# Altium schematic sheet 4 - IO Socket 2.SchDoc
size A4
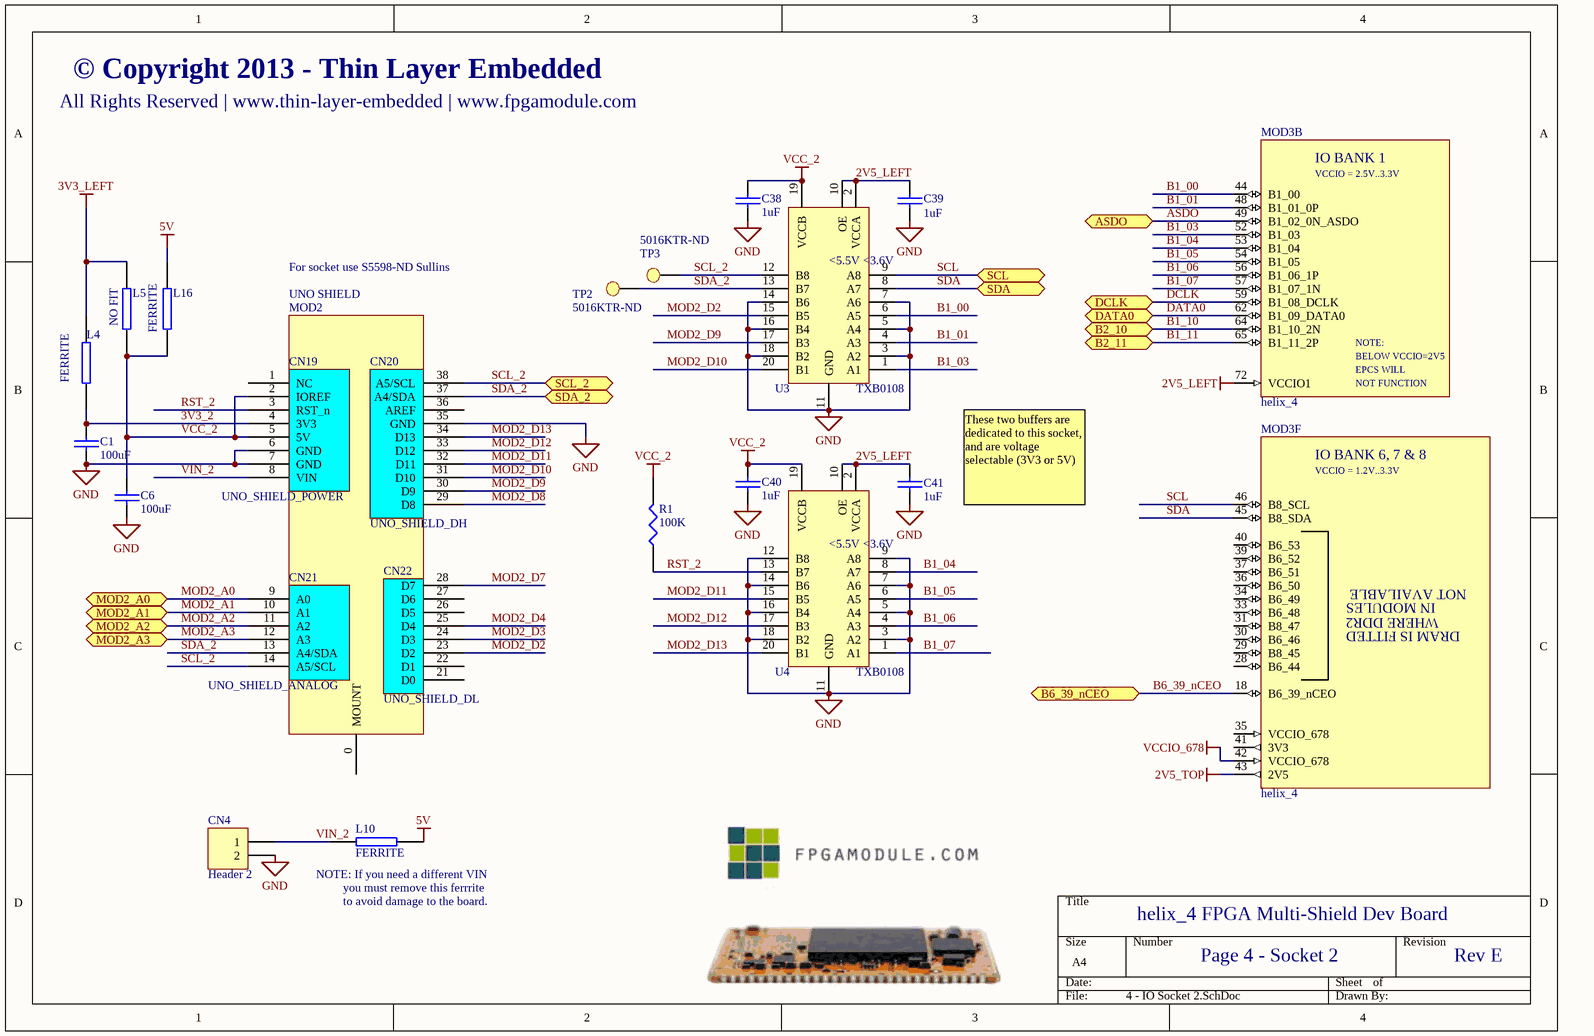
[diagram p0: 4 - IO Socket 2.SchDoc]

## Parts
C1  100uF  [1210]
C6  100uF  [1210]
C38  1uF  [0805]
C39  1uF  [0805]
C40  1uF  [0805]
C41  1uF  [0805]
CN4  Header 2  [HDR1X2]
CN19  UNO_SHIELD_POWER  [UNO_SHIELD_POWER]
CN20  UNO_SHIELD_DH  [UNO_SHIELD_DH]
CN21  UNO_SHIELD_ANALOG  [UNO_SHIELD_ANALOG]
CN22  UNO_SHIELD_DL  [UNO_SHIELD_DL]
L4  FERRITE  [0805]
L5  NO FIT  [0805]
L10  FERRITE  [0805]
L16  FERRITE  [0805]
MOD2  UNO SHIELD  [UNO_SHIELD_MECH]
MOD3  helix_4  [HELIX_4_LCC104_HOST]  (parts B,F of 7)
R1  100K  [0805]
TP2  Supplier Part Number 2: 5016KTR-ND  [TEST_POINT]  (hidden comment: Test Point)
TP3  Supplier Part Number 2: 5016KTR-ND  [TEST_POINT]  (hidden comment: Test Point)
U3  TXB0108  [TSSOP20]
U4  TXB0108  [TSSOP20]

## Ports
ASDO, B2_10, B2_11, B6_39_nCEO, DATA0, DCLK, MOD2_A0, MOD2_A1, MOD2_A2, MOD2_A3, SCL, SCL_2, SDA, SDA_2

## Nets
2V5_LEFT: C39.2 C41.2 MOD3.72(VCCIO1) U3.2(VCCA) U3.10(OE) U4.2(VCCA) U4.10(OE)
2V5_TOP: MOD3.43(2V5)
3V3_LEFT: L4.1 L5.1
5V: L10.1 L16.1
GND: C1.2 C6.2 C38.1 C39.1 C40.1 C41.1 CN4.2 CN19.6(GND) CN19.7(GND) CN20.35(GND) U3.3(A2) U3.5(A4) U3.7(A6) U3.11(GND) U3.14(B6) U3.16(B4) U3.18(B2) U4.3(A2) U4.5(A4) U4.7(A6) U4.9(A8) U4.11(GND) U4.12(B8) U4.14(B6) U4.16(B4) U4.18(B2)
VCC_2: C6.1 C38.2 C40.2 CN19.2(IOREF) CN19.5(5V) L5.2 L16.2 R1.2 U3.19(VCCB) U4.19(VCCB)
VCCIO_678: MOD3.42(VCCIO_678)
3V3_2: C1.1 CN19.4(3V3) L4.2
ASDO: MOD3.49(B1_02_0N_ASDO) ; port ASDO
B1_00: MOD3.44(B1_00) U3.6(A5)
B1_01: MOD3.48(B1_01_0P) U3.4(A3)
B1_03: MOD3.52(B1_03) U3.1(A1)
B1_04: MOD3.53(B1_04) U4.8(A7)
B1_05: MOD3.54(B1_05) U4.6(A5)
B1_06: MOD3.56(B1_06_1P) U4.4(A3)
B1_07: MOD3.57(B1_07_1N) U4.1(A1)
B1_10: MOD3.64(B1_10_2N) ; port B2_10
B1_11: MOD3.65(B1_11_2P) ; port B2_11
B6_39_nCEO: MOD3.18(B6_39_nCEO) ; port B6_39_nCEO
DATA0: MOD3.62(B1_09_DATA0) ; port DATA0
DCLK: MOD3.59(B1_08_DCLK) ; port DCLK
MOD2_A0: CN21.9(A0) ; port MOD2_A0
MOD2_A1: CN21.10(A1) ; port MOD2_A1
MOD2_A2: CN21.11(A2) ; port MOD2_A2
MOD2_A3: CN21.12(A3) ; port MOD2_A3
MOD2_D2: CN22.23(D2) U3.15(B5)
MOD2_D3: CN22.24(D3)
MOD2_D4: CN22.25(D4)
MOD2_D7: CN22.28(D7)
MOD2_D8: CN20.29(D8)
MOD2_D9: CN20.30(D9) U3.17(B3)
MOD2_D10: CN20.31(D10) U3.20(B1)
MOD2_D11: CN20.32(D11) U4.15(B5)
MOD2_D12: CN20.33(D12) U4.17(B3)
MOD2_D13: CN20.34(D13) U4.20(B1)
RST_2: CN19.3(RST_n) R1.1 U4.13(B7)
SCL: MOD3.46(B8_SCL) U3.9(A8) ; port SCL
SCL_2: CN20.38(A5/SCL) CN21.14(A5/SCL) TP3.1 U3.12(B8) ; port SCL_2
SDA: MOD3.45(B8_SDA) U3.8(A7) ; port SDA
SDA_2: CN20.37(A4/SDA) CN21.13(A4/SDA) TP2.1 U3.13(B7) ; port SDA_2
VIN_2: CN4.1 CN19.8(VIN) L10.2

Not connected (* = marked no-connect by the designer): CN19 1(NC); CN20 36(AREF); CN22 21(D0) 22(D1) 26(D5) 27(D6); MOD2 0(MOUNT); MOD3 28(B6_44) 29(B8_45) 30(B6_46) 31(B8_47) 33(B6_48) 34(B6_49) 35(VCCIO_678) 36(B6_50) 37(B6_51) 39(B6_52) 40(B6_53) 41(3V3)

## Notes on the sheet
- All Rights Reserved | www.thin-layer-embedded | www.fpgamodule.com
- © Copyright 2013 - Thin Layer Embedded
- For socket use S5598-ND Sullins
- These two buffers are dedicated to this socket, and are voltage selectable (3V3 or 5V)
- (near L10) NOTE: If you need a different VIN
- (near L10) you must remove this ferrrite
- to avoid damage to the board.
- helix_4 FPGA Multi-Shield Dev Board
- Page 4 - Socket 2
- Rev E
- (in symbol helix_4 Rev C Module, part B) IO BANK 1; VCCIO = 2.5V..3.3V; NOTE:; BELOW VCCIO=2V5; EPCS WILL; NOT FUNCTION
- (in symbol helix_4 Rev C Module, part F) IO BANK 6, 7 & 8; VCCIO = 1.2V..3.3V; NOT AVAILABLE; IN MODULES; WHERE DDR2; DRAM IS FITTED
- (in symbol TXB0108) <5.5V; <3.6V

## Library data of the parts
C1 C6 C38-C41 = CAP: Capacitor
CN4 = Header 2: Header, 2-Pin; LatestRevisionDate: 17-Jul-2002; LatestRevisionNote: Re-released for DXP Platform.; Publisher: Altium Limited
L5 = FERRITE
MOD2 = UNO_SHIELD_MECH
MOD3 = helix_4 Rev C Module
R1 = RES1
U3 U4 = TXB0108: TI Bir-dir buffer
TP2 TP3 = Test Point: Supplier 1: Digi-Key; Supplier 2: Digi-Key